# EAGLE board evpr (EAGLE 9.5.2)
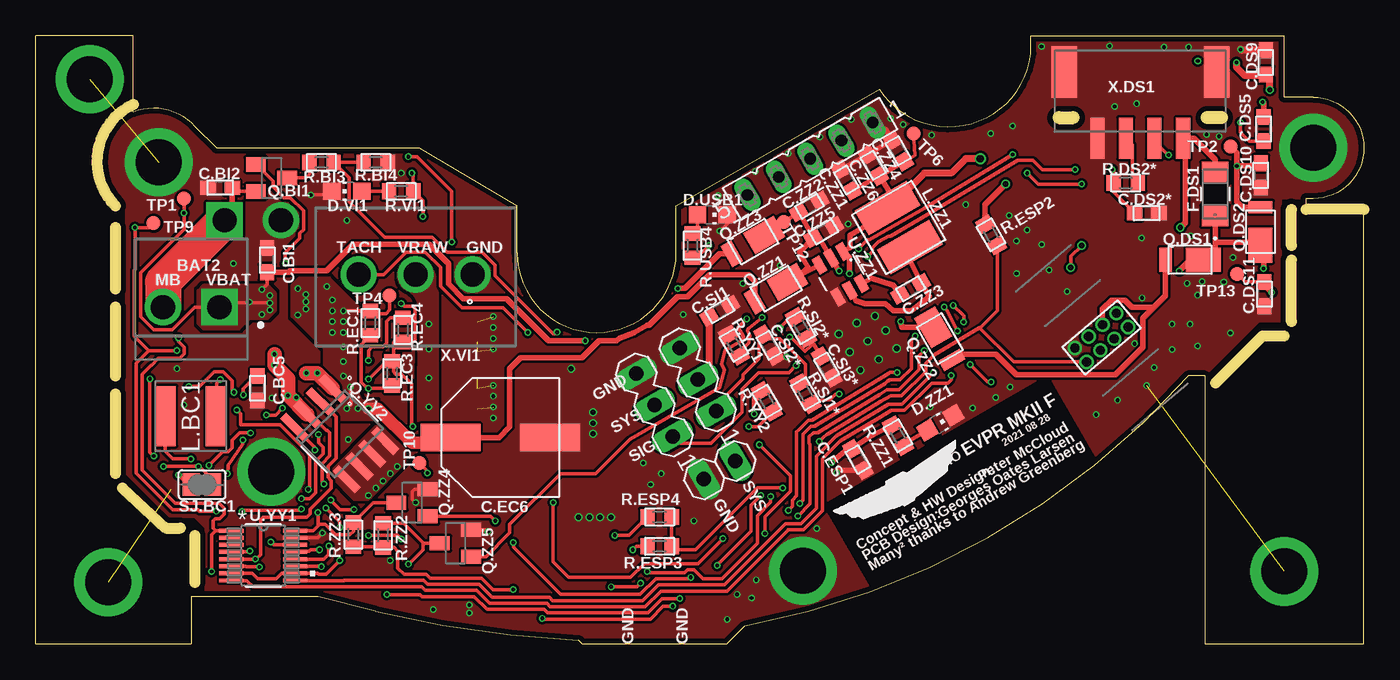
[diagram p2: board, top side]
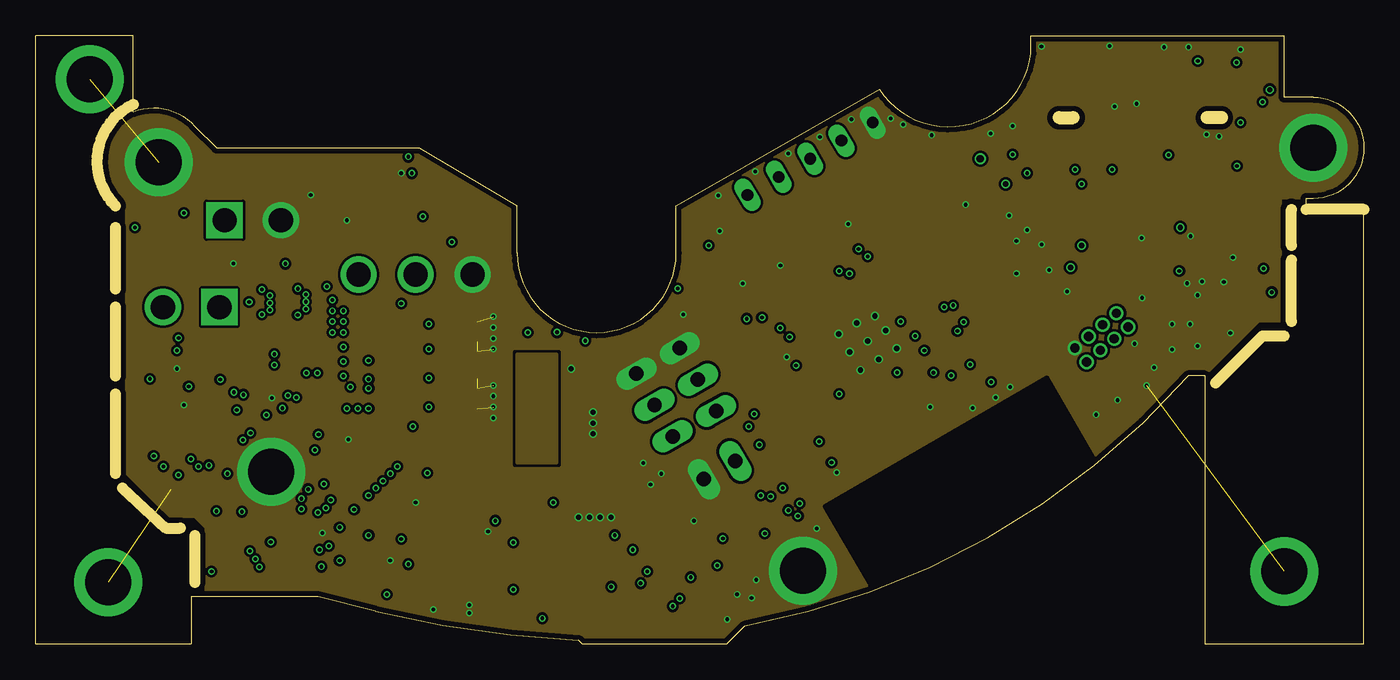
[diagram p3: board, inner layer Route2]
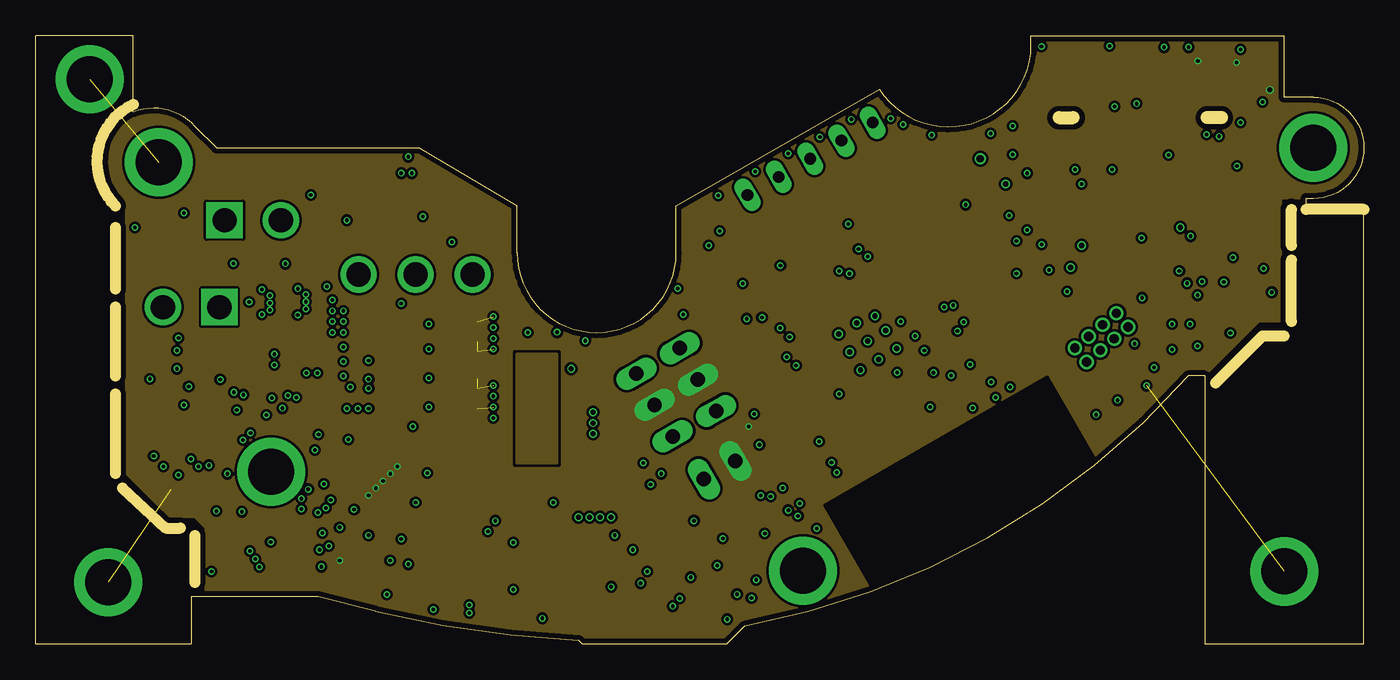
[diagram p4: board, inner layer Route15]
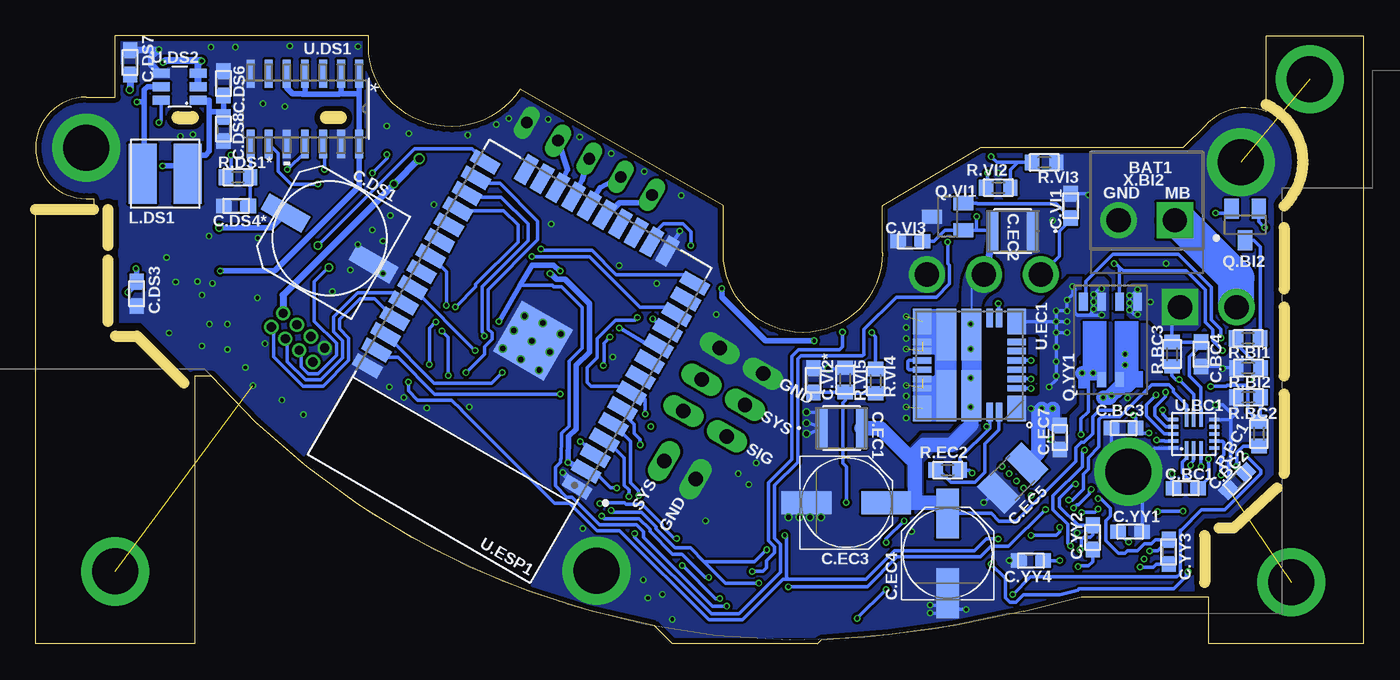
[diagram p5: board, bottom side, seen from below]

Size 93.22 x 42.67 mm. Coordinates in mm from the lower left corner, seen from the top.
Outline: 6.86,37.85 6.86,37.34 arc-70 11.18,36.32 12.7,34.8 26.92,34.8 33.78,30.73 33.78,27.43 arc180 44.96,27.43 44.96,30.73 59.21,38.91 arc140 69.85,41.4 69.85,42.67 87.63,42.67 87.63,38.35 89.66,38.35 arc-180 89.66,31.24 89.15,31.24 89.15,30.73 93.22,30.73 93.22,0 82.04,0 82.04,18.8 80.89,18.8 arc-38 49.78,1.27 48.51,0 38.35,0 38.1,0.25 arc-11 23.88,2.29 19.81,3.3 10.92,3.3 10.92,0 0,0 0,42.67 6.86,42.67 6.86,37.85
Outline: 11.18,7.62 11.18,4.32
Outline: 82.8,18.29 86.11,21.59 87.63,21.59
Outline: 88.14,22.61 88.14,26.92
Outline: 88.14,27.94 88.14,30.48
Outline: 5.59,29.21 5.59,24.89
Outline: 5.59,23.62 5.59,18.8
Outline: 5.59,17.53 5.59,11.94
Outline: 6.1,10.92 9.14,8.13 10.16,8.13
Outline: 6.86,37.85 arc110 5.59,30.73
Outline: 93.22,30.48 89.15,30.48
Copper layers (1*2*15*16): Top 0.035559375mm / dielectric 0.17018125mm / Route2 0.01778125mm / dielectric 47mil / Route15 0.01778125mm / dielectric 0.17018125mm / Bottom 0.035559375mm
Design rules "oshpark-4layer *": minimum track width 5mil, minimum drill 10mil, track to track 7mil, track to pad 7mil, pad to pad 7mil, via to via 7mil, smd to smd 5mil, copper to edge 15mil, drill to drill 6mil, minimum pad ring 4mil, minimum via ring 4mil, stop-mask expansion 2.5mil, vias tented up to drill 10mil, thermal gap 10mil
Milling: 12 lines

## Footprints (pad centres in the part's own frame; a part is rotated, then mirrored left to right if it is on the bottom)
C0603 = smd 1.1 x 1: 1 -0.85,0; 2 0.85,0
810RADCAN = smd 1.3 x 3.3: A$1 0,3.556; C$2 0,-3.556
CAP_3225 = smd 0.75 x 2.794: 1 -1.375,0; 2 1.375,0
OSCON_SVPF_6.3MM = smd 3.5 x 1.6: + 2.8,0; - -2.8,0
C1210 = smd 1.6 x 2.7: 1 -1.4,0; 2 1.4,0
C6CYLCAP = smd 4.2 x 1.9: P$1 -3.5,0; P$2 3.5,0
CHIP-LED0805 = smd 1.2 x 1.2: A 0,-1.05; C 0,1.05
C1-M = smd 1.473 x 1.88: 1 -1.524,0; 2 1.524,0
1X02 = drill 1.016 long: 1 -1.27,0; 2 1.27,0
SRN5040TA = smd 1.5 x 4.2: P$1 -1.8,0; P$2 1.8,0
SRR4818A-XXXX = smd 4.2 x 1.98: P$1 0,1.575; P$2 0,-1.575
SOT23 = smd 1 x 1.4: 1 -0.95,-1.1; 2 0.95,-1.1; 3 0,1.1
SOD-123HE1 = smd 0.85 x 1.7: A 1.725,0 | smd 2.45 x 1.7: C -0.925,0
POWERPAK_SO8DUAL = smd 1.02 x 0.61: D$1B 2.795,0.635; D$2A 2.795,-0.635 | smd 1.27 x 0.61: P$1 -2.67,1.905; P$2 -2.67,0.635; P$3 -2.67,-0.635; P$4 -2.67,-1.905
SOIC8 = smd 0.6 x 2.2: 1 -1.905,-2.6; 2 -0.635,-2.6; 3 0.635,-2.6; 4 1.905,-2.6; 5 1.905,2.6; 6 0.635,2.6; 7 -0.635,2.6; 8 -1.905,2.6
R0603 = smd 1 x 1.1: 1 -0.85,0; 2 0.85,0
SJ = smd 1.168 x 1.6: 1 -0.762,0; 2 0.762,0
PR20B04HBDN = drill 0.65 pad 1: P$1 -1.905,-0.635; P$2 -1.905,0.635; P$3 -0.635,-0.635; P$4 -0.635,0.635; P$5 0.635,-0.635; P$6 0.635,0.635; P$7 1.905,-0.635; P$8 1.905,0.635
MA03-1 = drill 1.016 long: 1 -2.54,0; 2 0,0; 3 2.54,0
TP10R = smd 1 x 1: TP 0,0
QFN16 = smd 0.25 x 0.7: !ACOK 1,1.45; !EN 0,-1.45; AGND 1,-1.45; BST -0.5,1.45; CELL -1,-1.45; NC 0.5,-1.45; NTC 0.5,1.45; PGND -1,1.45; SEL -0.5,-1.45; TMR 0,1.45 | smd 1.3 x 0.25: !CHOK 1.15,0.5; BAT 1.15,-0.5; CSP 1.15,0; SW -1.15,0.5; VCC -1.15,-0.5; VIN -1.15,0
D14 = smd 1.981 x 0.559: 1 -2.464,3.81; 2 -2.464,2.54; 3 -2.464,1.27; 4 -2.464,0; 5 -2.464,-1.27; 6 -2.464,-2.54; 7 -2.464,-3.81; 8 2.464,-3.81; 9 2.464,-2.54; 10 2.464,-1.27; 11 2.464,0; 12 2.464,1.27; 13 2.464,2.54; 14 2.464,3.81
TSOT23-6 = smd 0.62 x 1.22: 1 -0.95,-1.3; 2 0,-1.3; 3 0.95,-1.3; 4 0.95,1.3; 5 0,1.3; 6 -0.95,1.3
MOL0024A = smd 1.3 x 1.8: 1 -3.3,3.05; 8 -3.3,-3.05; 13 3.3,-3.05; 20 3.3,3.05 | smd 1.3 x 0.45: 2 -3.3,1.625; 3 -3.3,0.975; 4 -3.3,0.325; 5 -3.3,-0.325; 6 -3.3,-0.975; 7 -3.3,-1.625; 14 3.3,-1.625; 15 3.3,-0.975; 16 3.3,-0.325; 17 3.3,0.325; 18 3.3,0.975; 19 3.3,1.625 | smd 0.45 x 1.3: 9 -2.075,-3.3; 10 -1.425,-3.3; 23 -1.425,3.3; 24 -2.075,3.3 | smd 1.4 x 3.6: 11 -0.15,-2.15; 12 1.6,-2.15; 21 1.6,2.15; 22 -0.15,2.15
MODULE_ESP32-WROOM-32D = smd 2 x 0.9: 1 -8.5,5.26; 2 -8.5,3.99; 3 -8.5,2.72; 4 -8.5,1.45; 5 -8.5,0.18; 6 -8.5,-1.09; 7 -8.5,-2.36; 8 -8.5,-3.63; 9 -8.5,-4.9; 10 -8.5,-6.17; 11 -8.5,-7.44; 12 -8.5,-8.71; 13 -8.5,-9.98; 14 -8.5,-11.25; 25 8.5,-11.25; 26 8.5,-9.98; 27 8.5,-8.71; 28 8.5,-7.44; 29 8.5,-6.17; 30 8.5,-4.9; 31 8.5,-3.63; 32 8.5,-2.36; 33 8.5,-1.09; 34 8.5,0.18; 35 8.5,1.45; 36 8.5,2.72; 37 8.5,3.99; 38 8.5,5.26 | smd 0.9 x 2: 15 -5.715,-12.25; 16 -4.445,-12.25; 17 -3.175,-12.25; 18 -1.905,-12.25; 19 -0.635,-12.25; 20 0.635,-12.25; 21 1.905,-12.25; 22 3.175,-12.25; 23 4.445,-12.25; 24 5.715,-12.25 | smd 4.1 x 4.1: 39 -0.68,-2.08
MSOP-16_MS-M = smd 1.702 x 0.279: 1 -2.235,1.751; 2 -2.235,1.251; 3 -2.235,0.751; 4 -2.235,0.25; 5 -2.235,-0.25; 6 -2.235,-0.751; 7 -2.235,-1.251; 8 -2.235,-1.751; 9 2.235,-1.751; 10 2.235,-1.251; 11 2.235,-0.751; 12 2.235,-0.25; 13 2.235,0.25; 14 2.235,0.751; 15 2.235,1.251; 16 2.235,1.751
B2P-VH(LF)(SN) = drill 1.7 square: 1 -1.98,0 | drill 1.7: 2 1.98,0
BM04B-PASS-1-TFT(LF)(SN) = smd 1 x 2.9: P$1 -3,2.5; P$2 -1,2.5; P$3 1,2.5; P$4 3,2.5 | smd 1.8 x 3.6: P$5 5.35,-2.15; P$6 -5.35,-2.15
FE05-1 = drill 0.813 long: 1 -5.08,0; 2 -2.54,0; 3 0,0; 4 2.54,0; 5 5.08,0
B3P-VH(LF)(SN) = drill 1.7: 1 -4,0; 2 0,0; 3 4,0

## Placement (x,y rotation side)
C.BC1  0.1uF  [C0603]  12.5,10.92 0 bottom
C.BC2  0.1uF  [C0603]  8.89,11.43 45 bottom
C.BC3  22uF  [C0603]  16.87,15.14 180 bottom
C.BC4  22uF  [C0603]  11.43,20.32 270 bottom
C.BC5  0.47uF  [C0603]  15.57,17.93 90 top
C.BI1  0.1uF  [C0603]  16.26,26.92 90 top
C.BI2  0.1uF  [C0603]  12.95,32 180 top
C.DS1  1000µF  [810RADCAN]  72.59,28.45 60 bottom
C.DS2*  0.1uF  [C0603]  77.98,30.23 0 top
C.DS3  0.1uF  [C0603]  86.13,24.56 90 bottom
C.DS4*  0.1uF  [C0603]  79.15,30.72 180 bottom
C.DS5  0.1uF  [C0603]  86.18,36.12 90 top
C.DS6  22uF  [C0603]  80.04,39.32 90 bottom
C.DS7  10uF  [C0603]  86.59,40.79 90 bottom
C.DS8  22uF  [C0603]  80.04,36.12 270 bottom
C.DS9  0.1uF  [C0603]  86.33,40.79 270 top
C.DS10  0.1uF  [C0603]  85.98,32.87 90 top
C.DS11  0.1uF  [C0603]  86.23,24.54 90 top
C.EC1  10µF  [CAP_3225]  36.65,15.14 0 bottom
C.EC2  10µF  [CAP_3225]  24.64,28.96 180 bottom
C.EC3  56µF  [OSCON_SVPF_6.3MM]  36.32,9.91 0 bottom
C.EC4  56µF  [OSCON_SVPF_6.3MM]  29.21,6.35 90 bottom
C.EC5  47µF  [C1210]  24.64,11.63 225 bottom
C.EC6  220µF  [C6CYLCAP]  32.61,14.48 180 top
C.EC7  0.1uF  [C0603]  21.34,14.48 90 bottom
C.ESP1  0.1uF  [C0603]  57.71,12.93 120 top
C.SI1  0.1uF  [C0603]  48.01,23.37 210 top
C.SI2*  0.1uF  [C0603]  51.46,20.95 300 top
C.SI3*  0.1uF  [C0603]  55.52,19.43 300 top
C.VI1  0.1uF  [C0603]  20.57,30.73 90 bottom
C.VI2*  0.1uF  [C0603]  38.63,18.49 90 bottom
C.VI3  0.1uF  [C0603]  31.83,28.24 180 bottom
C.YY1  0.1uF  [C0603]  16.41,7.87 0 bottom
C.YY2  56 nF  [C0603]  19.02,7.47 90 bottom
C.YY3  56 nF  [C0603]  13.69,6.45 270 bottom
C.YY4  0.1uF  [C0603]  23.37,5.84 180 bottom
C.ZZ1  22uF  [C0603]  56.9,32.54 120 top
C.ZZ2  10uF  [C0603]  54.3,30.7 30 top
C.ZZ3  0.1uF  [C0603]  61.41,24.91 30 top
C.ZZ4  22uF  [C0603]  60.54,34.6 120 top
C.ZZ5  0.1uF  [C0603]  55.31,28.9 210 top
C.ZZ6  0.1uF  [C0603]  58.78,33.58 300 top
D.USB1  [CHIP-LED0805]  47.49,30.1 270 top
D.VI1  [CHIP-LED0805]  21.84,31.75 90 top
D.ZZ1  [CHIP-LED0805]  63.5,15.52 300 top
F.DS1  1A  [C1-M]  82.78,31.55 90 top
JP1  [1X02]  48.01,12.19 30 top
L.BC1  33uH  [SRN5040TA]  10.9,15.98 0 top
L.DS1  4.7µH  [SRR4818A-XXXX]  84.12,32.99 90 bottom
L.ZZ1  3.9µH  [SRR4818A-XXXX]  60.58,29.22 210 top
Q.BI1  BSS84-7-F  [SOT23]  16.56,32.69 270 top
Q.BI2  BSS84-7-F  [SOT23]  8.33,29.41 180 bottom
Q.DS1  SMD34LHE1  [SOD-123HE1]  81.03,26.95 180 top
Q.DS2  SMD34LHE1  [SOD-123HE1]  85.95,28.91 90 top
Q.VI1  [SOT23]  29.21,29.97 90 bottom
Q.YY1  SI7997DP  [POWERPAK_SO8DUAL]  17.78,21.34 270 bottom
Q.YY2  CSD88537NDT  [SOIC8]  21.34,14.73 225 top
Q.ZZ1  SMD34LHE1  [SOD-123HE1]  51.97,24.92 210 top
Q.ZZ2  SMD34LHE1  [SOD-123HE1]  63.45,21.41 300 top
Q.ZZ3  SMD34LHE1  [SOD-123HE1]  50.34,28.22 210 top
Q.ZZ4  DMN5L06K-7  [SOT23]  26.42,9.91 90 top
Q.ZZ5  DMN5L06K-7  [SOT23]  29.46,7.06 90 top
R.BC1  100k  [R0603]  7.37,14.73 270 bottom
R.BC2  100k  [R0603]  8.1,17.3 0 bottom
R.BC3  0.25  [R0603]  13.46,20.32 90 bottom
R.BI1  47.5k  [R0603]  8.13,21.44 0 bottom
R.BI2  22.1k  [R0603]  8.1,19.35 0 bottom
R.BI3  47.5k  [R0603]  20.07,33.78 180 top
R.BI4  22.1k  [R0603]  23.88,33.78 180 top
R.DS1*  0  [R0603]  79.02,32.74 0 bottom
R.DS2*  0  [R0603]  76.5,32.33 180 top
R.EC1  10k 0.1%  [R0603]  23.49,22.5 270 top
R.EC2  37.4kΩ 1%  [R0603]  29.21,12.19 180 bottom
R.EC3  768Ω 0.1%  [R0603]  25.02,18.97 270 top
R.EC4  95.3kΩ  [R0603]  25.78,22.02 270 top
R.ESP2  10k  [R0603]  67.06,28.7 300 top
R.ESP3  100k  [R0603]  43.79,6.85 180 top
R.ESP4  100k  [R0603]  43.79,8.9 180 top
R.SI1*  0  [R0603]  54.03,17.55 300 top
R.SI2*  0  [R0603]  53.72,22.2 120 top
R.USB4  250Ω  [R0603]  46.1,27.94 270 top
R.VI1  500  [R0603]  25.65,31.75 0 top
R.VI2  100k  [R0603]  25.65,32 180 bottom
R.VI3  22.1k  [R0603]  22.43,33.78 180 bottom
R.VI4  100k  [R0603]  34.26,18.44 90 bottom
R.VI5  22.1k  [R0603]  36.4,18.52 270 bottom
R.YY1  22.1k  [R0603]  49.02,20.95 300 top
R.YY2  100k  [R0603]  51.31,17.02 300 top
R.ZZ1  250Ω  [R0603]  60.53,14.6 120 top
R.ZZ2  100k  [R0603]  24.38,7.62 90 top
R.ZZ3  100k  [R0603]  22.3,7.67 90 top
SJ.BC1  [SJ]  11.68,11.18 0 top
SV1  PR20B04HBDN  [PR20B04HBDN]  74.8,21.49 40 top
SV2  [MA03-1]  46.48,18.54 120 top
SV3  [MA03-1]  43.43,16.76 120 top
TP1  PTR1TP10R  [TP10R]  10.41,31.24 90 top
TP2  PTR1TP10R  [TP10R]  83.87,34.9 90 top
TP4  PTR1TP10R  [TP10R]  24.84,24.43 180 top
TP6  PTR1TP10R  [TP10R]  61.62,35.81 0 top
TP9  PTR1TP10R  [TP10R]  8.28,29.51 90 top
TP10  PTR1TP10R  [TP10R]  26.92,12.7 180 top
TP12  PTR1TP10R  [TP10R]  52.5,29.6 30 top
TP13  PTR1TP10R  [TP10R]  84.33,25.96 90 top
U.BC1  MP2615  [QFN16]  11.94,14.73 90 bottom
U.DS1  SN74AHCT125DR  [D14]  74.32,37.54 270 bottom
U.DS2  [TSOT23-6]  83.11,39.09 90 bottom
U.EC1  TPSM84824MOLR  [MOL0024A]  27.69,19.56 180 bottom
U.ESP1  ESP32-WROOM-32D  [MODULE_ESP32-WROOM-32D]  59.94,19.81 150 bottom
U.YY1  LTC4353CMSPBFMSOP-16_MS-M  [MSOP-16_MS-M]  15.98,6.2 0 top
U.ZZ1  [TSOT23-6]  56.48,25.93 210 top
X.BI1  B2P-VH(LF)(SN)  [B2P-VH(LF)(SN)]  10.92,23.62 180 top
X.BI2  B2P-VH(LF)(SN)  [B2P-VH(LF)(SN)]  15.24,29.72 180 bottom
X.DS1  BM04B-PASS-1-TFT(LF)(SN)  [BM04B-PASS-1-TFT(LF)(SN)]  77.52,37.97 180 top
X.ESP1  [FE05-1]  54.36,34.04 210 top
X.VI1  B3P-VH(LF)(SN)  [B3P-VH(LF)(SN)]  26.67,25.91 180 top

## Tracks (layer width: path | path; a pad name or v marks a point on that pad's centre or on a via)
5.0V  (via drill 0.25)
  Top 0.254: TP13.TP 84.89,25.4 86.2,25.4 C.DS11.2
  Top 0.381: v80.26,26.16 81.05,26.95 Q.DS1.C 82.78,27.78 82.78,28.19 | F.DS1.1 82.78,28.19 | 82.78,28.19 85.74,28.19 Q.DS2.C 86.18,27.75 v86.18,26.34 | v86.75,24.67 86.2,25.22 86.2,25.4
  Bottom 0.381: 70.51,38.61 U.DS1.14 70.51,32.11 76.45,26.16 v80.26,26.16 | 70.51,38.61 U.DS1.1 | U.DS1.5 75.59,39.01 75.18,38.61 74.42,38.61 | 70.51,38.61 71.88,38.61 | U.DS1.2 71.78,38.71 71.88,38.61 | 71.88,38.61 71.93,38.56 74.47,38.56 74.42,38.61 | U.DS1.4 74.32,38.71 74.42,38.61 | v86.18,26.34 86.13,26.29 C.DS3.2 86.13,25.29 v86.75,24.67
!ACOK  (via drill 0.25)
  Top 0.254: v14.11,16.4 14.38,16.13 14.38,15.36 17.15,15.36 18.59,13.93 18.62,13.93 19.07,13.48 19.07,13.39 19.23,13.24 19.23,10.95 v19.13,10.85 | v20.37,9.52 21.34,8.56 v21.34,8.18 | v23.37,7.62 25.4,7.62 v25.65,7.37 | v64.39,23.75 65.13,23.01 v65.13,22.59 | v67.06,18.38 66.8,18.38 v65.57,19.6 | R.ESP4.2 41.65,7.62 v40.64,7.62
  Bottom 0.254: U.BC1.!ACOK 13.75,15.73 14.11,16.09 v14.11,16.4 | v19.13,10.85 19.25,10.72 19.25,10.53 20.03,9.76 20.14,9.76 v20.37,9.52 | v21.34,8.18 21.34,7.87 21.59,7.62 v23.37,7.62 | v25.65,7.37 26.49,7.37 27.33,6.53 32.95,6.53 34.93,4.54 40.39,4.54 | U.ESP1.31 64.39,26.11 v64.39,23.75 | v65.13,22.59 65.57,22.15 v65.57,19.6 | v67.06,18.38 67.06,17.75 66.4,17.09 64.01,17.09 63.32,16.41 63.32,16.39 56.8,9.86 55.76,9.86 53.82,7.92 52.22,7.92 45.97,1.68 43.62,1.68 40.76,4.54 40.39,4.54 | v40.64,7.62 40.51,7.49 40.51,4.67 40.39,4.54
!BAT_EN  (via drill 0.25)
  Top 0.254: Q.BI1.1 16.66,32.45 16.66,32.06 17.42,31.3 17.87,31.3 18.8,30.37 18.8,29.06 18.54,28.81 18.54,28.45 17.53,27.43 v17.53,26.67 | Q.ZZ4.3 23.69,9.91 R.ZZ3.2 22.3,7.91 22.03,7.65 21.06,7.65 20.32,8.38 19.91,8.38 | 19.91,8.38 19.81,8.38 v19.81,9.22 | 19.91,8.38 19.48,7.95 U.YY1.16 | v9.91,20.57 7.95,20.57 | 7.95,20.57 7.05,19.68 7.05,11.99 9.63,9.41 11.39,9.41 11.49,9.31 v12.7,9.31 | 7.95,20.57 6.93,21.59 6.93,26.23 6.97,26.27 v6.97,29.21 7.98,29.21 TP9.TP | v14.48,9.27 14.58,9.37 17.65,9.37 17.66,9.38 18.57,9.38 v18.64,9.46
  Bottom 0.254: Q.YY1.P$2 17.14,26.42 | v17.53,26.67 17.4,26.67 17.14,26.42 | 17.14,26.42 16.89,26.16 12.46,26.16 11.13,24.83 11.13,22.56 10.59,22.02 10.59,21.26 v9.91,20.57 | Q.BI2.1 7.38,29.62 v6.97,29.21 | v12.7,9.31 14.44,9.31 v14.48,9.27 | v19.81,9.22 18.88,9.22 v18.64,9.46
!CHGOK  (via drill 0.25)
  Top 0.254: v60.45,19.05 59.94,19.05 59.88,18.98 54.49,15.69 54.23,15.69 53.56,15.02 53.41,14.87 53.41,10.39 53.1,10.08 53.1,9.64 v52.83,9.37 | v20.71,10.09 21.37,9.43 v22.35,9.43 | v42.46,4.26 42.21,4.01 v40.39,4.01 | v41.91,6.6 42.16,6.85 R.ESP3.2
  Bottom 0.254: U.ESP1.36 65.25,18.29 61.21,18.29 v60.45,19.05 | U.BC1.!CHOK 12.44,16.76 13.39,17.7 13.39,17.87 13.7,18.19 14.88,18.19 17.13,15.94 18.39,15.94 18.59,15.74 18.59,13.81 19.34,13.07 19.34,12.27 19.68,11.92 19.68,10.86 20.46,10.09 v20.71,10.09 | v22.35,9.43 24.95,6.83 26.19,6.83 26.92,6.1 32.77,6.1 34.86,4.01 v40.39,4.01 | 52.83,9.4 v52.83,9.37 52.68,9.22 50.68,9.22 49.68,8.22 49.68,8.08 48.33,6.73 47.27,6.73 46.31,5.76 | v42.46,4.26 44.8,4.26 46.31,5.76 | 46.31,5.76 42.75,5.76 v41.91,6.6
!ENG_EN  (via drill 0.25)
  Top 0.254: Q.ZZ5.3 27.18,7.06 | R.ZZ2.2 25.82,8.47 27.18,7.11 27.18,7.06 | v10.04,21.46 10.04,21.2 10.44,20.8 10.44,20.35 10.13,20.04 8.62,20.04 8.14,19.56 8.13,19.56 7.48,18.91 7.48,12.19 9.81,9.87 12.9,9.87 13.23,9.53 13.23,9.09 12.92,8.78 12.59,8.78 12.45,8.64 12.45,8.36 12.46,8.34 12.46,8.13 12.64,7.95 | 12.64,7.95 U.YY1.1 14.41,7.95 | 12.64,7.95 12.35,7.66 v12.35,5.08 | 27.18,7.06 27.18,6.6 v26.16,5.59
  Bottom 0.254: v10.04,21.46 v10.03,21.46 10.03,22.07 10.7,22.74 10.7,25.01 13.02,27.33 17.62,27.33 19.51,25.44 19.51,24.18 Q.YY1.P$4 | v12.35,5.08 12.45,4.98 12.45,4.75 13.34,3.86 19.99,3.86 20.08,3.77 21.33,3.46 23.88,3.46 24.42,2.92 24.86,2.92 25.17,3.24 25.17,4.6 v26.16,5.59
!USING_BAT  (via drill 0.25)
  Top 0.254: U.YY1.9 21.66,4.45 27.23,4.45 27.5,4.18 31.12,4.18 32.03,3.28 35.81,3.28 36.06,3.28 36.29,3.04 42.61,3.04 43.71,4.14 48.33,4.14 52.63,8.44 53.72,8.44 54.78,9.5 54.78,13.17 56.2,14.59 59.86,16.82 60.8,16.82 62.91,18.92 v63.01,19.02
  Bottom 0.254: v63.01,19.02 61.7,20.33 61.7,20.86 61.19,21.37 61.19,21.81 61.47,22.09 61.47,24.86 57.99,28.34 57.99,29.65 60.64,32.3 61.91,32.3 U.ESP1.26
!USING_ENG  (via drill 0.25)
  Top 0.254: U.YY1.8 14.83,4.45 15.28,3.99 27.08,3.99 27.32,3.75 30.94,3.75 31.85,2.84 35.88,2.84 36.11,2.61 42.78,2.61 43.88,3.71 48.54,3.71 52.83,8 | 52.81,8 52.83,8 | 52.83,8 53.9,8 55.22,9.33 55.22,12.97 56.5,14.25 59.13,15.83 60.05,16.38 60.98,16.38 62.89,18.29 64.01,18.29 64.26,18.54 v64.26,18.82 | v63.75,23.62 63.96,23.42 v64.69,21.95
  Bottom 0.254: v64.26,18.82 64.26,21.51 v64.69,21.95 | v63.75,23.62 62.33,25.04 62.33,25.22 59.36,28.19 59.36,29.39 60.36,30.39 63.45,30.39 63.57,30.5 U.ESP1.28
AGND  (via drill 0.25)
  Top 0.254: v23.37,18.57 24.62,19.82 R.EC3.1 25.11,19.92 | v25.65,23.88 25.85,23.68 26.46,23.68 26.64,23.5 26.64,21.34 26.47,21.17 R.EC4.2 25.11,21.17 25.11,19.92 | v26.46,15.25 26.38,15.34 26.38,18.24 25.69,18.93 25.27,18.93 25.11,19.08 25.11,19.92 | TP10.TP 27.48,12.14 v27.48,11.99
  Bottom 0.254: U.EC1.3 23.37,18.58 v23.37,18.57 | U.EC1.23 26.26,15.14 | U.EC1.9 25.61,23.83 v25.65,23.88 | 26.26,15.14 28.36,13.04 R.EC2.1 27.69,12.19 v27.48,11.99 | 26.26,15.14 26.37,15.25 v26.46,15.25
  pour Route15 (no thermals): 33.78,20.32 33.78,12.7 36.58,12.7 36.58,20.32
  pour Route2 (no thermals): 33.78,20.32 33.78,12.7 36.58,12.7 36.58,20.32
BAT_EN  (via drill 0.25)
  Top 0.254: v53.5,8.97 54.34,9.81 54.34,14 54.27,14.07 54.27,14.52 54.59,14.83 54.93,14.83 54.98,14.85 54.96,14.85 59.22,17.47 59.74,17.83 60.6,17.83 61.99,19.23 61.99,20.2 v62.37,20.58 | Q.ZZ4.1 31.94,8.96 v32.26,8.64 | 33.57,7.12 v33.53,7.12 33.53,6.77 36.83,3.47 42.43,3.47 43.53,4.57 45.87,4.57 v45.97,4.67
  Bottom 0.254: v53.5,8.97 53.32,8.79 50.86,8.79 50.11,8.04 50.11,7.9 48.51,6.3 47.86,6.3 46.24,4.67 v45.97,4.67 | U.ESP1.33 66.76,24.97 v62.37,20.58 | v32.26,8.64 33.53,7.37 v33.53,7.12
BATSENSE1  (via drill 0.25)
  Top 0.254: v8.02,18.6 8.02,13.45 v8.29,13.18 | v24.64,3.46 27,3.46 27.14,3.32 30.76,3.32 31.67,2.41 35.7,2.41 35.93,2.18 42.96,2.18 43.96,3.17 v45.21,3.17 | v50.89,10.41 50.22,9.74 50.22,7.9 v47.83,5.51
  Bottom 0.254: R.BI1.1 8.98,21.08 R.BI2.2 v8.01,18.6 v8.02,18.6 | v8.29,13.18 8.23,13.18 7.24,12.19 7.24,11.94 9.77,9.41 11.39,9.41 12.82,7.98 12.89,7.98 12.89,4.92 13.11,4.7 23.4,4.7 v24.64,3.46 | v50.89,10.41 50.89,10.73 51.47,11.31 51.47,14.21 U.ESP1.5 | v45.21,3.17 45.5,3.17 v47.83,5.51
BATSENSE2  (via drill 0.25)
  Top 0.254: R.BI4.2 R.BI3.1 21.99,32.71 21.99,31.02 24.5,28.52 27.83,28.52 28.86,27.49 31.32,27.49 32.25,26.56 32.25,25.83 36.32,21.76 36.49,21.76 v36.59,21.86 | v51.58,10.34 51.58,9.92 50.65,8.99 50.65,7.07 48.15,4.57 46.83,4.57 46.2,5.21 45.75,5.21 45.55,5 43,5 v42.93,5.08
  Bottom 0.254: U.ESP1.4 53.17,14.31 51.91,13.04 51.91,11.13 51.58,10.8 v51.58,10.34 | v36.59,21.86 36.59,20.85 36.81,20.63 39.69,20.63 40.15,20.17 40.15,12.95 | 40.15,12.95 40.15,12.94 | 40.15,12.95 41.78,11.32 41.78,7.23 41.38,6.83 41.38,6.38 41.91,5.85 41.91,5.33 42.16,5.08 v42.93,5.08
BOOTMODE  (via drill 0.38)
  Top 0.254: v72.64,26.42 72.64,27.18 v73.41,27.94
  Bottom 0.254: SV1.P$3 74.58,20.45 74.58,19.43 74.1,18.95 73.41,18.95 72.1,20.25 72.1,21.09 73.66,22.65 73.66,25.4 v72.64,26.42 | v73.41,27.94 66.63,34.72 63.5,34.72 62.87,34.72 62.6,34.72 U.ESP1.25
DS_CLK  (via drill 0.25)
  Top 0.254: v57.75,27.71 58.38,28.35 58.51,28.35 62.37,30.57 68.54,34.31 v68.56,34.32 | v73.41,32.26 70.36,32.26 v69.6,33.02
  Bottom 0.254: v57.75,27.71 57.64,27.61 54.17,27.61 52.47,25.91 47.56,25.91 U.ESP1.14 | U.DS1.9 76.2,34.42 76.2,33.16 75.29,32.26 v73.41,32.26 | v69.6,33.02 68.56,34.06 v68.56,34.32
DS_DAT  (via drill 0.25)
  Top 0.254: v58.4,27.18 58.73,27.5 58.73,27.8 59.14,28.21 59.84,28.61 60.01,28.61 62.63,30.13 68.95,33.93 70,33.93 70.66,33.27 v72.95,33.27
  Bottom 0.254: U.ESP1.12 48.74,23.61 50.79,23.61 54.35,27.18 v58.4,27.18 | U.DS1.12 72.95,34.98 v72.95,33.27
ENG_EN  (via drill 0.25)
  Top 0.254: Q.ZZ5.1 31.6,6.11 33.27,7.78 33.27,8.38 36.84,11.95 39.31,11.95 41.71,14.35 47.99,17.98 48.33,19.25 48.12,19.61 48.39,20.61 49.62,21.31 49.68,21.55 49.3,22.2 v49.91,22.81
  Bottom 0.254: v49.91,22.81 49.11,22.01 U.ESP1.11
ESP_POWER  (via drill 0.25, 0.38, 0.51)
  Top 0.254: TP6.TP 61.72,34.29 61.09,33.86 C.ZZ4.1 | v52.44,10.95 50.67,10.95 46.33,6.6 44.88,6.6 R.ESP3.1 R.ESP4.1
  Top 0.381: C.ZZ6.2 C.ZZ4.1 | C.ZZ6.2 60.38,30.98 60.26,30.9 L.ZZ1.P$2 59.48,30.4 59.29,30.29 58.35,29.35 57.15,28.66 57.15,27.8 U.ZZ1.1 57.11,27.07 v57.11,25.97 | C.ZZ1.1 C.ZZ6.2 | v55.85,12.73 56.98,13.66 C.ESP1.2 57.42,13.8 58.49,14.49 R.ZZ1.2 60.08,15.32 | R.ESP2.1 66.63,30.82 v68.07,32.26
  Top 0.508: v66.29,34.04 65.28,34.04 64.26,33.02 62.38,33.02 60.26,30.9
  Bottom 0.254: v52.44,10.95 52.86,10.95 54.02,12.11 U.ESP1.2
  Bottom 0.381: U.ESP1.2 54.72,12.24 v55.85,12.73 55.81,14.55 55.29,15.07 55.29,19.53 54.36,20.47 54.36,23.88 56.05,25.57 56.66,25.57 57.06,25.97 v57.11,25.97
  Bottom 0.508: SV1.P$8 75.85,24.48 v68.07,32.26 v66.29,34.04
ESP_RX
  Bottom 0.254: U.ESP1.34 68.13,24.64 70.61,24.64 72.31,22.94 72.31,21.91 71.67,21.27 71.67,20.07 73.23,18.52 74.28,18.52 75.56,19.8 75.56,21.27 SV1.P$5
ESP_TX
  Bottom 0.254: U.ESP1.35 69.43,24.21 70.43,24.21 71.88,22.76 71.88,22.09 71.24,21.45 71.24,19.89 73.05,18.08 74.45,18.08 76.53,20.16 76.53,22.08 SV1.P$7
GND  (via drill 0.25, 0.35, 0.38, 3.23 pad 4.78)  (9 unrouted)
  Top 0.254: 48.54,29.49 v48.01,28.96 | 18.22,7.46 U.YY1.15 19.79,7.45 v20.12,7.77 | D.VI1.C 20.54,31.5 v19.3,31.5 | Q.ZZ4.2 26.6,10.86 26.42,10.67 26.42,10.16 v26.67,9.91 | Q.ZZ5.2 31.61,8.01 v31.75,7.87
  Top 0.381: X.ESP1.1 59.69,36.07 C.ZZ4.2 C.ZZ6.1 C.ZZ1.2 | v56.21,12.01 56.39,12.19 C.ESP1.1
  Top 0.508: C.DS9.1 84.64,41.64 84.57,41.72
  Bottom 0.254: 16.46,11.99 v16.53,12.06 17.72,13.24 C.BC3.2 | v48.01,28.96 U.ESP1.15 | v19.3,31.5 19.39,31.58 C.VI1.2 | U.BC1.AGND 9.41,15.73 9.14,16 | 9.14,16 8.95,16.19 R.BC2.1 8.95,16.23 9.35,15.84 9.35,12.9 9.49,12.76 C.BC2.1 | 9.14,16 9.91,16.76 v10.41,16.76 | R.BI2.1 9.85,19.35 v9.91,19.3 10.07,19.47 C.BC4.2 | U.BC1.PGND 14.72,13.73 16.46,11.99 | C.EC7.1 21.34,13.74 v21.95,14.35 | C.YY4.2 v24.88,5.84 | C.EC5.2 25.93,10.64 v26.67,9.91 | 29.21,2.79 C.EC4.- | v27.91,2.41 28.83,2.41 29.21,2.79 | v30.43,2.16 29.84,2.16 29.34,2.67 | 29.34,2.67 29.21,2.79 | v30.43,2.72 29.39,2.72 29.34,2.67 | C.YY1.2 15.56,11.09 16.46,11.99 | R.VI5.1 36.46,19.3 v37.59,19.3 37.63,19.34 C.VI2*.2 | v39.12,15.49 38.89,15.49 C.EC1.1 | v39.12,14.73 38.94,14.73 C.EC1.1 | v38.1,8.89 C.EC3.- | v38.86,8.89 38.86,9.65 C.EC3.- | v39.62,8.89 39.62,9.4 C.EC3.- | v40.39,8.89 39.37,9.91 C.EC3.- | 38.61,16.26 v39.12,16.26 37.85,16.26 37.85,15.32 C.EC1.1
  Bottom 0.381: U.ESP1.1 v56.21,12.01
  Bottom 0.508: C.DS7.2 84.62,41.64 v84.56,41.71 85.09,41.17 85.09,40.62 84.5,40.04 U.DS2.4
  other vias: 8.64,33.78 53.85,5.13 89.66,34.8 56.36,21.74 57.12,20.47 57.89,19.2 59.16,19.96 58.39,21.23 57.63,22.5 58.9,23.01 59.66,22 60.43,20.73 48.54,1.73 50.57,4.5 54.81,8.1 65.76,16.56 67.39,17.27 62.79,16.61 52.27,26.54 47.9,31.45 50.5,33.15 52.81,34.39 55.04,35.56 57.25,36.8 57.02,29.46 62.89,35.69 60.02,36.86 60.88,36.45 70.59,41.91 75.36,41.94 79.2,41.86 80.92,41.86 77.27,37.9 75.72,37.69 82.17,35.74 83.06,35.61 84.02,27.1 81.05,28.6 77.62,28.47 77.11,21.06 77.65,24.28 80.8,25.3 81.86,25.43 81.53,24.46 83.85,21.82 83.39,25.4 49.23,3.48 50.24,3.23 32.13,15.85 32.13,16.61 32.13,17.37 32.13,18.14 32.13,20.68 32.13,21.44 32.13,22.2 32.13,22.96 49.63,25.27 52.7,20.12 21.84,29.72 25.65,33.02 16.59,17.25 87.63,5.08 5.08,4.32 3.81,39.62 68.4,18.03 79.76,20.65 81.03,22.43 79.76,22.43 65.28,30.81 68.33,30.05 69.6,29.03 68.83,28.27 70.61,28.02 71.12,26.24 68.83,25.98 72.39,24.71 74.42,16.08 75.95,17.09 77.98,18.11 78.49,19.38 81.53,20.9 67.03,35.81 68.55,36.32 43.15,11.18 43.92,11.94 42.65,12.7 45.44,23.11 46.2,8.64 13.87,26.7
  pour Top (rank 2, no thermals): 6.35,30.99 6.1,31.24 arc-180 11.18,36.32 12.7,34.8 26.92,34.8 33.78,30.73 33.78,27.43 arc180 44.96,27.43 44.96,30.73 59.21,38.91 arc140 69.85,41.4 69.85,42.67 87.63,42.67 87.63,38.35 89.66,38.35 arc-180 89.66,31.24 87.38,31.24 87.38,22.61 85.85,22.61 82.04,18.8 80.89,18.8 arc-38 49.78,1.27 48.51,0 38.35,0 38.1,0.25 arc-11 23.88,2.29 19.81,3.3 11.94,3.3 11.94,8.13 11.18,8.89 9.4,8.89 6.35,11.94
  pour Bottom (rank 4, no thermals): 6.35,30.99 6.1,31.24 arc-180 11.18,36.32 12.7,34.8 26.92,34.8 33.78,30.73 33.78,27.43 arc180 44.96,27.43 44.96,30.73 59.21,38.91 arc140 69.85,41.4 69.85,42.67 87.63,42.67 87.63,38.35 89.66,38.35 arc-180 89.66,31.24 87.38,31.24 87.38,22.61 85.85,22.61 82.04,18.8 80.89,18.8 arc-38 49.78,1.27 48.51,0 38.35,0 38.1,0.25 arc-11 23.88,2.29 19.81,3.3 11.94,3.3 11.94,8.13 11.18,8.89 9.4,8.89 6.35,11.94
  cutout Top: 55.4,9.73 70.97,18.69 75.41,11.04 59.86,2
  cutout Bottom: 55.4,9.73 70.97,18.69 75.41,11.04 59.86,2
  cutout Route15: 55.4,9.73 70.97,18.69 75.41,11.04 59.86,2
  cutout Bottom (rank 3): 31.57,23.47 31.6,23.37 31.6,20.22 30.23,20.22 30.23,18.85 31.6,18.87 31.6,15.67 28.47,15.7 29.11,14.94 28.4,15.54 28.32,24.28 28.4,24.28 arc48 28.55,23.8 arc-75 28.55,23.47 28.6,23.37
  pour Route2 (rank 4, no thermals): 6.35,30.99 6.1,31.24 arc-180 11.18,36.32 12.7,34.8 26.92,34.8 33.78,30.73 33.78,27.43 arc180 44.96,27.43 44.96,30.73 59.21,38.91 arc140 69.85,41.4 69.85,42.67 87.63,42.67 87.63,38.35 89.66,38.35 arc-180 89.66,31.24 87.38,31.24 87.38,22.61 85.85,22.61 82.04,18.8 80.89,18.8 arc-38 49.78,1.27 48.51,0 38.35,0 38.1,0.25 arc-11 23.88,2.29 19.81,3.3 11.94,3.3 11.94,8.13 11.18,8.89 9.4,8.89 6.35,11.94
LED_BUILTIN  (via drill 0.25)
  Top 0.254: v47.24,27.94 46.39,27.09 R.USB4.2
  Bottom 0.254: v47.24,27.94 47.22,27.96 47.22,28.92 47.78,29.49 49.15,29.49 49.97,28.67 U.ESP1.16
N$3  (via drill 0.25)
  Top 0.254: R.EC3.2 24.83,17.93 v23.37,17.93 23.27,18.04 23.15,18.04 22.83,18.35 22.83,20.99 R.EC1.2
  Bottom 0.254: U.EC1.2 v23.37,17.93
N$4  (via drill 0.25)
  Top 0.254: U.YY1.12 20.22,5.95 20.57,6.3 v20.57,6.86 | v19.61,13.61 19.61,13.77 Q.YY2.4
  Bottom 0.254: v19.61,13.61 19.77,13.45 19.77,12.44 21.82,10.39 21.82,9.42 20.78,8.38 20.78,7.06 v20.57,6.86
N$5  (via drill 0.25)
  Top 0.254: U.YY1.4 14.96,6.45 v15.04,6.53 | v18.64,10.19 19.23,10.19 19.66,10.62 19.66,12.81 20.19,13.34 20.19,13.79 19.86,14.13 v19.86,14.7
  Top 1.016: Q.YY2.1 v19.76,19 18.97,19
  Bottom 0.254: v15.04,6.53 14.46,6.53 C.YY3.1 14.62,7.3 14.9,7.03 15.41,7.03 15.9,6.54 16.6,6.54 16.78,6.35 17.23,6.35 18.11,7.24 18.11,8.64 17.78,8.97 17.78,9.5 18.47,10.19 v18.64,10.19 | v19.76,19 19.35,18.59 19.35,16.3 19.86,15.79 v19.86,14.7 | Q.YY1.D$2A 18.54,18.54 v19,19 18.77,19
  Bottom 1.016: 18.77,19 v19.76,19
N$6  (via drill 0.25)
  Top 0.254: U.YY1.13 18.27,6.5 19.19,6.5 19.29,6.6 v19.93,6.6 | v20.22,11.22 20.09,11.35 20.09,12.63 20.65,13.19 20.65,14.8 20.46,14.99 20.38,14.99 19.3,16.06 19.3,16.12 | 19.33,16.12 19.3,16.12 | 19.3,16.12 Q.YY2.3 19.05,16.51 v18.29,17.27
  Top 1.016: Q.YY2.3 19.02,16.12 v17.71,17.43 17.71,18.61 v16.76,19.56 v16.76,20.32
  Bottom 0.254: v19.93,6.6 19.83,6.71 19.83,7.29 19.65,7.47 19.2,7.47 19.02,7.65 C.YY2.2 20.05,8.32 21.36,9.63 21.36,10.21 20.35,11.22 v20.22,11.22 | v16.76,19.56 Q.YY1.D$1B | v17.71,17.43
  Bottom 0.381: v17.71,17.43 17.24,17.43 16.83,17.84 16.45,17.84 16,18.29 16.76,19.05 v16.76,19.56
  Bottom 1.016: 16.76,20 16.76,18.38 v17.71,17.43 | v17.71,17.43 17.87,17.27 v18.29,17.27
N$7  (via drill 0.25)
  Top 0.254: v14.58,17.48 14.58,17.88 15.48,18.78 C.BC5.2
  Bottom 0.254: v14.58,17.48 15.26,16.79 15.26,15.99 14.01,14.73 U.BC1.TMR
N$8
  Top 0.254: C.BI2.1 14.07,31.74 Q.BI1.2
  Top 0.381: X.BI2.1 13.8,30.26 C.BI2.1
  Top 2.54: X.BI2.1 8.94,25.4 X.BI1.2
  Bottom 2.54: X.BI1.2 8.94,25.65 13.01,29.72 X.BI2.1
N$9  (via drill 0.25)
  Top 0.254: C.ZZ2.1 TP12.TP 52.06,29.6 Q.ZZ3.C | R.ZZ3.1 24.33,6.82 R.ZZ2.1 25.15,6.77 25.41,6.5 25.41,5.32 25.85,4.88 27.41,4.88 27.67,4.62 31.3,4.62 32.1,3.81 v33.53,3.81 | v35.56,1.8 35.61,1.74 43.14,1.74 44.04,2.64 v44.7,2.64
  Top 0.381: C.ZZ5.2 53.59,27.49 54.22,26.42 53.18,25.38 Q.ZZ1.C 52.83,25.47 55,26.57 U.ZZ1.3 | C.ZZ5.2 55.12,28.27 U.ZZ1.2 v56.39,26.16 | C.ZZ5.2 C.ZZ2.1 | Q.ZZ2.C 60.8,22.21 v60.71,22.61
  Bottom 0.254: 59.2,25.16 56.95,25.16 56.86,25.07 56.31,25.07 54.86,23.62 54.86,20.74 55.79,19.81 55.79,15.28 56.3,14.76 56.3,14.56 56.34,12.99 56.39,12.95 56.39,12.73 56.74,12.38 56.74,12.08 56.74,12.07 56.74,11.09 55.94,10.3 55.58,10.3 53.64,8.36 51.04,8.36 50.55,7.86 50.55,7.47 47.95,4.88 45.72,2.64 v44.7,2.64 | v33.53,3.81 33.55,3.81 v35.56,1.8
  Bottom 0.381: v60.71,22.61 59.2,25.16 58.37,26.57 58.06,26.57 56.87,26.57 56.46,26.16 v56.39,26.16
N$10  (via drill 0.25)
  Top 0.254: U.YY1.5 v15.42,5.95 v15.43,5.96 15.48,5.96 15.79,6.26 15.79,8.72 15.96,8.9 19.04,8.9 19.28,9.14 19.28,9.44 20.75,10.91 20.75,11.46 20.52,11.69 20.52,12.45 21.1,13.03 21.1,15.94 20.02,17.02 Q.YY2.2
N$11
  Top 0.254: R.SI1*.1 54.03,18.72 54.03,19.62 52.24,21.41 51.31,21.41 C.SI2*.1 50.78,21.44 50.78,20 49.65,18.87 49.65,18.62 47.75,16.72 SV2.1
N$12  (via drill 0.25)
  Top 0.254: v52.91,21.54 52.99,21.54 54.01,20.52 54.43,20.93 | v53.36,19.53 52.86,19.02 50.72,19.02 49.56,17.86 49.56,16.25 47.39,14.08 45.19,14.08 SV3.1 | R.SI2*.1 54.45,20.95 54.43,20.93 | C.SI3*.1 54.57,21.07 54.43,20.93
  Bottom 0.254: v52.91,21.54 53.34,21.11 53.34,19.56 v53.36,19.53
N$13
  Bottom 0.254: R.BI1.2 7.28,27.85 7.74,28.31 Q.BI2.3
N$14
  Top 0.381: U.ZZ1.6 58.67,25.65 60.2,25.15 C.ZZ3.1
N$15
  Bottom 0.254: U.EC1.16 31.93,19.88 32,19.81 32,19.3 31.93,19.23 U.EC1.17
N$17
  Bottom 0.254: R.EC2.2 29.84,12.19 28.99,11.34 27.31,11.34 26.61,12.04 26.61,14.05 25.72,14.93 25.71,14.93 25.61,15.03 U.EC1.24
N$22  (via drill 0.25)
  Top 0.254: v75.55,33.27 75.66,33.17 R.DS2*.2 75.66,31.7 C.DS2*.1
  Bottom 0.254: v75.55,33.27 74.32,34.51 U.DS1.11
N$23
  Top 0.254: D.VI1.A R.VI1.1
N$24
  Top 0.254: R.USB4.1 46.44,29.13 D.USB1.A
N$26
  Top 0.381: U.ZZ1.5 57.56,24.08 58.22,23.85 59.64,23.85 60.2,23.37 61.47,23.37 62.74,24.38 C.ZZ3.2 61.21,27.18 L.ZZ1.P$1
N$27
  Bottom 0.254: U.DS1.8 78.13,32.78 R.DS1*.2 78.17,30.85 C.DS4*.1
N$28  (via drill 0.38)
  Top 0.127: 80.67,34.44 X.DS1.P$1
  Top 0.381: F.DS1.2 82.78,33.98 81.28,35.47 X.DS1.P$1 | v80.34,29.21 80.67,29.55 80.67,34.44
  Bottom 0.381: v80.34,29.21 76.69,29.21 C.DS1.A$1
N$29  (via drill 0.25)
  Top 0.254: C.DS5.1 85.17,35.27 84.56,35.88 v84.56,36.58
  Bottom 0.254: v84.56,36.58 84.41,36.73 U.DS2.6
N$30  (via drill 0.25)
  Top 0.254: X.DS1.P$2 78.52,35.27 v79.5,34.29
  Bottom 0.254: R.DS1*.1 79.5,33.11 v79.5,34.29
N$31  (via drill 0.25)
  Top 0.254: v23.37,19.88 23.37,20.57 23.62,20.83 24.38,20.83 24.64,21.08 24.64,22.62 24.89,22.87 R.EC4.1
  Bottom 0.254: U.EC1.5 v23.37,19.88
N$32  (via drill 0.25)
  Top 0.254: U.YY1.14 16.69,6.95 v16.5,7.14
  Bottom 0.254: v16.5,7.14 16.52,7.14 C.YY1.1
N$33
  Top 0.254: Q.BI1.3 18.97,32.69 19.22,32.93 R.BI3.2
N$36
  Top 0.254: D.ZZ1.A 61.32,14.24 R.ZZ1.1
N$37  (via drill 0.25)
  Top 0.254: v20.07,5.41 20.03,5.45 U.YY1.11
  Bottom 0.254: v20.07,5.41 20.01,5.47 19.34,5.47 19.02,5.78 C.YY2.1
N$38  (via drill 0.25)
  Top 0.254: U.YY1.6 14.73,5.45 14.78,5.4 15.7,5.4 v15.71,5.38
  Bottom 0.254: C.YY3.2 14.58,5.6 14.79,5.38 v15.71,5.38
N$42
  Top 0.254: X.DS1.P$3 76.96,35.03 76.96,32.73 R.DS2*.1
N$48  (via drill 0.25)
  Top 0.254: v10.74,18.06 11.5,18.06 12.51,19.08 13.17,19.08 13.78,18.47 13.78,17.8 v13.92,17.65
  Bottom 0.254: R.BC2.2 7.25,15.7 R.BC1.1 8.15,16.36 8.15,17.97 8.33,18.15 9.58,18.15 9.67,18.06 v10.74,18.06 | v13.92,17.65 13.92,17.35 14.66,16.61 14.66,15.99 13.9,15.23 U.BC1.NTC
N$49
  Bottom 0.381: X.ESP1.5 50.5,30.96 52.22,30.96 53.07,30.1 U.ESP1.19
N$50  (via drill 0.25)
  Top 0.381: v86.11,38.02 86.18,37.95 C.DS5.2
  Bottom 0.381: U.DS2.5 85.37,39.09 85.6,38.86 85.6,38.02 | 85.6,38.02 85.6,33.1 L.DS1.P$1 | 85.6,38.02 v86.11,38.02
N$51  (via drill 0.25)
  Top 0.381: C.DS10.2 85.89,33.53 v84.3,33.53 | Q.DS2.A 84.69,30.63 84.3,31.01 v84.3,33.53 | TP2.TP 84.3,34.47 v84.3,33.53
  Bottom 0.381: L.DS1.P$2 82.82,33.26 | 82.82,33.26 83.08,33.53 v84.3,33.53 | C.DS6.1 C.DS8.1 80.39,37.33 81.03,37.33 | U.DS2.1 81.03,38.14 81.03,37.33 | 81.03,37.33 81.03,34.54 81.28,34.29 82.55,34.29 82.82,34.02 82.82,33.26
N$52  (via drill 0.25)
  Top 0.254: SJ.BC1.2 12.45,11.48 11.48,12.45 v11.43,12.45 v8.96,12.45
  Bottom 0.254: U.BC1.VCC v11.44,12.45 v11.43,12.45 | C.BC2.2 8.25,12.06 8.58,12.06 v8.96,12.45 8.96,12.68 8.91,12.72 8.91,13.44 8.47,13.88 R.BC1.2
N$56  (via drill 0.25)
  Top 0.254: L.BC1.P$2 12.7,18.29 v12.95,18.54
  Bottom 0.254: R.BC3.1 13.46,18.8 13.21,18.54 v12.95,18.54 11.94,17.53 U.BC1.CSP
N$58  (via drill 0.25)
  Top 0.254: SJ.BC1.1 10.69,11.18 v10.03,11.84
  Bottom 0.254: v10.03,11.84 10.03,13.08 9.83,13.28 9.83,14.15 9.91,14.23 U.BC1.SEL
N$59  (via drill 0.25)
  Top 0.254: v14.55,14.29 14.55,14.01 13.51,12.55 v13.46,11.94
  Bottom 0.254: U.BC1.BST 13.99,14.23 14,14.25 14.5,14.25 v14.55,14.29 | v13.46,11.94 13.46,11.04 C.BC1.1
N$60  (via drill 0.25)
  Top 0.254: v10.9,12.98 9.63,12.98 9.1,13.51 L.BC1.P$1
  Bottom 0.254: U.BC1.SW 12.45,13.03 12.72,12.75 12.72,12 C.BC1.2 10.9,11.67 10.9,12.67 v10.9,12.98
N$66
  Bottom 0.381: U.ESP1.20 53.59,32 X.ESP1.4
N$68
  Bottom 0.381: U.ESP1.21 54.86,32.51 X.ESP1.3
N$70
  Bottom 0.381: U.ESP1.22 55.88,33.27 X.ESP1.2
RAWSENSE  (via drill 0.25)
  Top 0.254: v50.8,13.97 52.97,11.8 52.97,10.71 51.18,8.92 v51.18,7.74 | v29.21,28.19 29.21,31.75 26.78,34.18 v26.16,34.18
  Bottom 0.254: v50.8,13.97 50.8,14.35 51.22,14.77 51.22,15.4 52.04,16.21 U.ESP1.6 | R.VI2.1 24.8,33.27 24.3,33.78 R.VI3.2 25.77,33.78 v26.16,34.18 | v29.21,28.19 29.21,26.68 29.09,26.56 29.09,25.25 30.02,24.33 32.81,24.33 35.08,22.06 35.08,20.3 35.17,20.2 39.51,20.2 39.72,19.99 39.72,12.76 41.35,11.12 41.35,7.41 40.95,7 40.95,5.01 43.85,2.11 45.8,2.11 51.18,7.49 v51.18,7.74
RESET  (via drill 0.25)
  Top 0.254: v54.99,14.19 55.29,14.49 55.55,14.7 55.56,14.7 59.34,17.01 60.02,17.4 60.78,17.4 62.48,19.1 62.48,19.69 63.06,20.28 66.25,22.18 | 66.25,22.18 66.36,22.24 67.48,23.37 R.ESP2.2 | SV1.P$1 68.65,19.78 66.25,22.18
  Bottom 0.254: U.ESP1.3 54.95,14.22 v54.99,14.19
SERVO1  (via drill 0.25)
  Top 0.254: v56.39,17.53 56.13,17.53 55.75,17.14 54.73,17.09 R.SI1*.2
  Bottom 0.254: U.ESP1.37 68.79,20.1 67.78,20.1 65.2,17.53 57.11,17.53 57.09,17.51 57.02,17.53 v56.39,17.53
SERVO2  (via drill 0.25)
  Top 0.254: v52.25,22.17 53.01,22.94 R.SI2*.2
  Bottom 0.254: v52.25,22.17 50.14,20.91 U.ESP1.10
SYS_POWER  (via drill 0.25, 0.35)
  Top 0.254: U.YY1.7 15.19,4.95 15.57,4.57 16.89,4.57 17.27,4.95 U.YY1.10 19.78,4.95 19.84,4.88 20.37,4.88 v21.34,5.84 | R.YY2.2 50.69,15.24 v50.04,15.24
  Top 0.508: v84.28,40.78 84.28,40.44 84.84,39.88 86.27,39.88 C.DS9.2 86.61,39.66 v86.61,38.86 | C.SI1.2 47.27,19.33 SV2.2
  Bottom 0.254: C.YY4.1 v21.34,5.84
  Bottom 0.508: U.DS2.2 U.DS2.3 81.81,40.65 v81.56,40.89 84.17,40.89 v84.28,40.78 | C.DS7.1 86.59,38.89 v86.61,38.86
  other vias: 25.4,12.45 24.89,11.94 24.38,11.43 23.88,10.92 23.37,10.41
  cutout Route2: 55.37,9.65 70.97,18.72 75.39,11.05 59.84,1.98
  pour Top (no thermals): 23.88,15.24 20.83,12.19 20.83,11.68 22.35,10.16 23.37,10.16 25.91,12.7 25.91,13.72 24.38,15.24
  pour Route15 (rank 4, no thermals): 6.35,30.99 6.1,31.24 arc-180 11.18,36.32 12.7,34.8 26.92,34.8 33.78,30.73 33.78,27.43 arc180 44.96,27.43 44.96,30.73 59.21,38.91 arc140 69.85,41.4 69.85,42.67 87.63,42.67 87.63,38.35 89.66,38.35 arc-180 89.66,31.24 87.38,31.24 87.38,22.61 85.85,22.61 82.04,18.8 80.89,18.8 arc-38 49.78,1.27 48.51,0 38.35,0 38.1,0.25 arc-11 23.88,2.29 19.81,3.3 11.94,3.3 11.94,8.13 11.18,8.89 9.4,8.89 6.35,11.94
SYS_SENSE  (via drill 0.25)
  Top 0.254: v50.44,16.13 50.38,16.2 50.38,17.25 R.YY2.1 | R.YY1.2 49.45,20.49 50.08,21.12 50.08,21.38 50.14,21.62 49.95,21.96 49.99,22.12 50.09,22.18 v50.98,22.88
  Bottom 0.254: v50.44,16.13 50.44,17.17 50.88,17.61 U.ESP1.7 51.9,17.61 52.35,18.06 54.22,18.06 54.53,18.37 54.53,19.37 53.82,20.08 53.82,21.41 52.52,22.71 51.16,22.71 v50.98,22.88
TACH  (via drill 0.25)
  Top 0.254: v61.72,21.59 61.47,21.34 61.47,19.31 60.67,18.52 59.94,18.52 59.77,18.41 59.62,18.26 54.67,15.26 54.41,15.26 53.84,14.7 53.84,10.07 v53.63,9.86 | v36.32,9.91 36.32,5.76 37.41,4.67 41.76,4.67 42.73,5.64 46.49,5.64 v48.24,7.39
  Bottom 0.254: U.ESP1.27 62.7,31.35 60.56,31.35 58.67,29.46 58.67,28.27 61.9,25.04 61.9,21.91 61.72,21.73 v61.72,21.59 | R.VI5.2 36.32,17.59 R.VI4.1 | R.VI5.2 38.61,17.67 C.VI2*.1 | R.VI5.2 36.4,17.11 36.58,16.93 36.58,12.67 36.32,12.42 v36.32,9.91 | v53.63,9.86 53.58,9.91 51.9,9.91 51.8,9.8 50.66,9.8 49.25,8.4 49.25,8.26 48.38,7.39 v48.24,7.39
TACH_RAW  (via drill 0.25)
  Top 0.254: X.VI1.3 24.44,25.91 26.02,27.49 27.32,27.49 28.4,26.41 28.4,25.1 29.94,23.57 32.82,23.57 v34.54,21.84
  Bottom 0.254: X.VI1.3 21.38,27.2 21.38,28.96 20.57,29.76 C.VI1.1 | Q.VI1.2 27.16,30.92 27.13,30.89 21.58,30.89 C.VI1.1 | v34.54,21.84 34.27,21.56 R.VI4.2 | 20.23,29.88 C.VI1.1
VBAT  (via drill 0.25)
  Top 0.254: v16.43,23.93 13.21,23.93 X.BI1.1 11.18,23.62 9.6,22.04 8.29,22.04 7.36,22.97 7.36,26.05 10.41,29.1 v10.41,30.23 TP1.TP | v15.87,24.87 16.26,25.25 C.BI1.1
  Top 0.381: v45.06,24.94 45.57,24.94 47.98,27.36 Q.ZZ3.A | v38.57,21.27 36,21.27 33.04,24.23 30.02,24.23 28.99,25.25 28.99,26.66 27.63,28.02 22.29,28.02 20.44,26.16 17.86,26.16 17.77,26.07 17.28,26.07 C.BI1.1
  Bottom 0.254: v10.41,30.23 9.57,30.23 Q.BI2.2 | Q.YY1.P$1 16.35,24.01 v16.43,23.93 | v16.43,23.93 v16.43,24.43 16.31,24.43 v15.87,24.87 | v16.43,23.93 v16.43,23.42 16.13,23.11 v15.87,23.11 | X.BI1.1 13.46,23.06 R.BC3.2 C.BC4.1 11.43,20.95 12.23,20.15 12.23,18.79 11.44,18 U.BC1.BAT | v38.57,21.27 38.64,21.27
  Bottom 0.381: 38.64,21.27 38.64,21.26 42.01,21.26 45.06,24.31 v45.06,24.94
  other vias: 14.99,23.98
  pour Top (no thermals): 11.43,22.5 11.43,24.74 11.84,25.15 16.26,25.15 16.76,24.64 16.76,23.37 16.26,22.86 14.99,22.86 14.22,22.1 11.84,22.1
  pour Bottom (no thermals): 11.43,22.5 11.43,24.74 11.84,25.15 16.26,25.15 16.76,24.64 16.76,23.37 16.26,22.86 14.99,22.86 14.22,22.1 11.84,22.1
VCONV  (via drill 0.25)
  Top 0.254: TP4.TP 24.84,23.43 24.58,23.17 23.68,23.17 R.EC1.1 21.6,23.35 v21.59,23.37 | v22.1,18.03 22.1,17.52 22.14,17.48 22.14,16.8 v21.84,16.51
  Top 0.381: Q.ZZ1.A 50.47,25.43 50.02,25.88 47.3,25.88 45.76,24.35 45.05,24.35 43.06,22.36 42.92,22.36 41.99,21.82 40.97,21.45 40.79,21.26 39.55,21.26 38.35,20.07 34.04,20.07 33.27,19.3 33.27,15.24 32.51,14.48 C.EC6.P$2
  Top 0.889: C.EC6.P$2 28.73,14.1 26.42,14.1 24,16.51 v23.37,16.51
  Bottom 0.254: v22.1,18.03 21.59,18.54 v21.59,18.8 v21.59,19.81 v21.59,20.83 v21.59,21.84 | v21.59,21.84 v20.83,21.84 | v20.83,22.61 v21.59,22.61 | v21.59,22.61 v21.59,21.84 | v21.59,22.61 v21.59,23.37 v20.83,23.37 v20.83,24.13 20.42,24.54 20.42,25.04 | 19.25,23.07 20.12,23.07 20.29,23.24 20.29,24.92 20.42,25.04 | 19.25,23.07 19.07,23.24 19.07,23.39 v18.97,23.49 v18.97,24 | v20.45,25.07 20.42,25.04 | v18.97,24 v18.97,24.51 18.57,24.92 v18.41,24.92 | v18.39,23.06 v18.39,23.07 19.25,23.07 | v18.97,24 Q.YY1.P$3 | U.EC1.8 v21.59,22.61
  Bottom 1.016: v21.84,16.51 21.84,15.49 21.68,15.33 C.EC7.2 | C.EC5.1 22.86,13.41 22.86,16.26 v22.61,16.51
  pour Bottom: 24.89,17.27 22.86,17.27 22.61,17.53 22.61,21.59 22.86,21.84 24.89,21.84 24.89,23.37 22.86,23.37 20.57,25.65 18.29,25.65 18.03,25.4 18.03,22.35 20.32,20.07 20.32,16.92 21.49,15.75 24.89,15.75
  pour Top: 18.03,23.37 18.03,25.15 18.54,25.65 20.57,25.65 22.61,23.62 22.61,17.53 22.86,17.02 23.88,17.02 23.88,15.75 21.49,15.75 20.32,16.92 20.32,20.73 18.03,23.01
VPROG
  Top 0.381: Q.ZZ2.A 64.71,20.32 67.4,20.32 68.84,18.88 75.78,18.88 77.71,20.81 77.71,22.85 78.49,23.62 | 78.49,23.62 76.93,23.62 76.45,24.1 75.48,24.1 74.88,23.49 SV1.P$6 | 78.49,23.62 78.61,23.75 79.3,24.44 Q.DS1.A
VRAW  (via drill 0.25)
  Top 0.254: v12.17,12.53 13.13,13.5 13.5,13.5 13.78,13.78 13.78,14.28 14.32,14.83 15.04,14.83 v15.09,14.78 | v27.18,29.97 27.18,31.08 R.VI1.2 26.5,32.93 v26.42,33.02 | v17.32,16.53 16.84,16.05 v16.2,16.05
  Bottom 0.127: X.VI1.2 27.54,25.04 U.EC1.11 | 27.54,20.83 27.54,17.53 U.EC1.22
  Bottom 0.254: C.VI3.1 30.17,28.25 29.4,29.02 Q.VI1.1 27.18,29.02 | U.BC1.VIN 11.95,13.56 11.95,12.83 12.17,12.62 v12.17,12.53 | C.EC2.2 26.58,29.02 27.18,29.02 | v15.09,14.78 15.54,14.78 15.9,15.14 C.BC3.1 16.02,15.86 v16.2,16.05 | C.EC4.+ 26.15,9.15 25.62,8.62 24.41,8.62 20.2,12.83 20.2,13.78 19.83,14.15 19.63,14.15 19.02,14.76 19.02,15.92 18.57,16.38 17.48,16.38 v17.32,16.53 | v27.18,29.97 27.18,29.02 | R.VI2.2 26.42,32.09 v26.42,33.02 | U.EC1.11 27.54,20.83 | U.EC1.22 27.54,16.76 | U.EC1.11 27.54,22.41 v27.58,22.45 | U.EC1.11 27.58,21.66 v27.58,20.68 | U.EC1.22 27.54,18.59 v27.58,18.64 | U.EC1.22 27.58,17.36 v27.58,16.61
  Bottom 0.508: C.EC2.2 26.52,26.06 X.VI1.2
  Bottom 1.016: 31.57,13.28 31.83,13.03 33.93,15.14 C.EC1.2 | 31.57,13.28 30.89,13.97 28.96,13.97 27.54,15.39 27.54,16.76 27.54,17.53 | C.EC3.+ 31.5,9.91 | 31.5,9.91 31.5,13.21 31.57,13.28 | C.EC4.+ 29.97,9.91 31.5,9.91
  pour Bottom (no thermals): 26.85,23.52 arc70 26.11,24.77 arc-102 25.63,26.62 arc-119 27.84,26.39 arc-24 28.24,24.56 arc-1 28.24,23.34 arc-181 26.85,23.37
  pour Top (no thermals): 26.85,23.42 arc70 26.11,24.75 arc-102 25.63,26.61 arc-119 27.84,26.38 arc-24 28.25,24.55 28.24,23.39 28.24,15.6 26.82,15.6 26.85,23.41
  pour Bottom: 26.9,15.75 26.9,14.77 28.63,13.46 30.23,13.46 30.99,12.7 30.99,9.65 31.5,9.14 32,9.14 32,13.61 30.94,14.73 28.96,14.73 28.19,15.49 28.19,15.75

## Text on the board
tPlace: TACH | VRAW | GND | BAT2 | MB | VBAT | GND | SYS | 2021 08 28 | SIG | EVPR MKII F | Peter McCloud / Georges Oates Larsen | SYS | GND | MCCLOUD AERO | Concept & HW Design: / PCB Design: / Many² thanks to Andrew Greenberg | GND | GND
bPlace: BAT1 | MB | GND | GND | SYS | SIG | SYS | GND